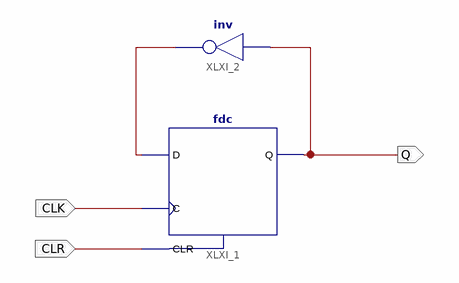
[diagram p0: schematic sheet 1]
// Xilinx ISE schematic toggler.sch (xbr) as structural Verilog: 2 symbols, 3 ports
module toggler (
  input  CLK,
  input  CLR,
  output Q
);

  wire XLXN_1;

  fdc XLXI_1 (.C(CLK), .CLR(CLR), .D(XLXN_1), .Q(Q));
  not XLXI_2 (XLXN_1, Q);
endmodule
